# Altium schematic sheet BREW_MONITOR.SchDoc
size A3; Author: Marc-Andre Guimond; Organization: Geni Ale; Address1: 1100; Address2: Notre-Dame Ouest; Address3: Montreal, QC; Address4: Canada
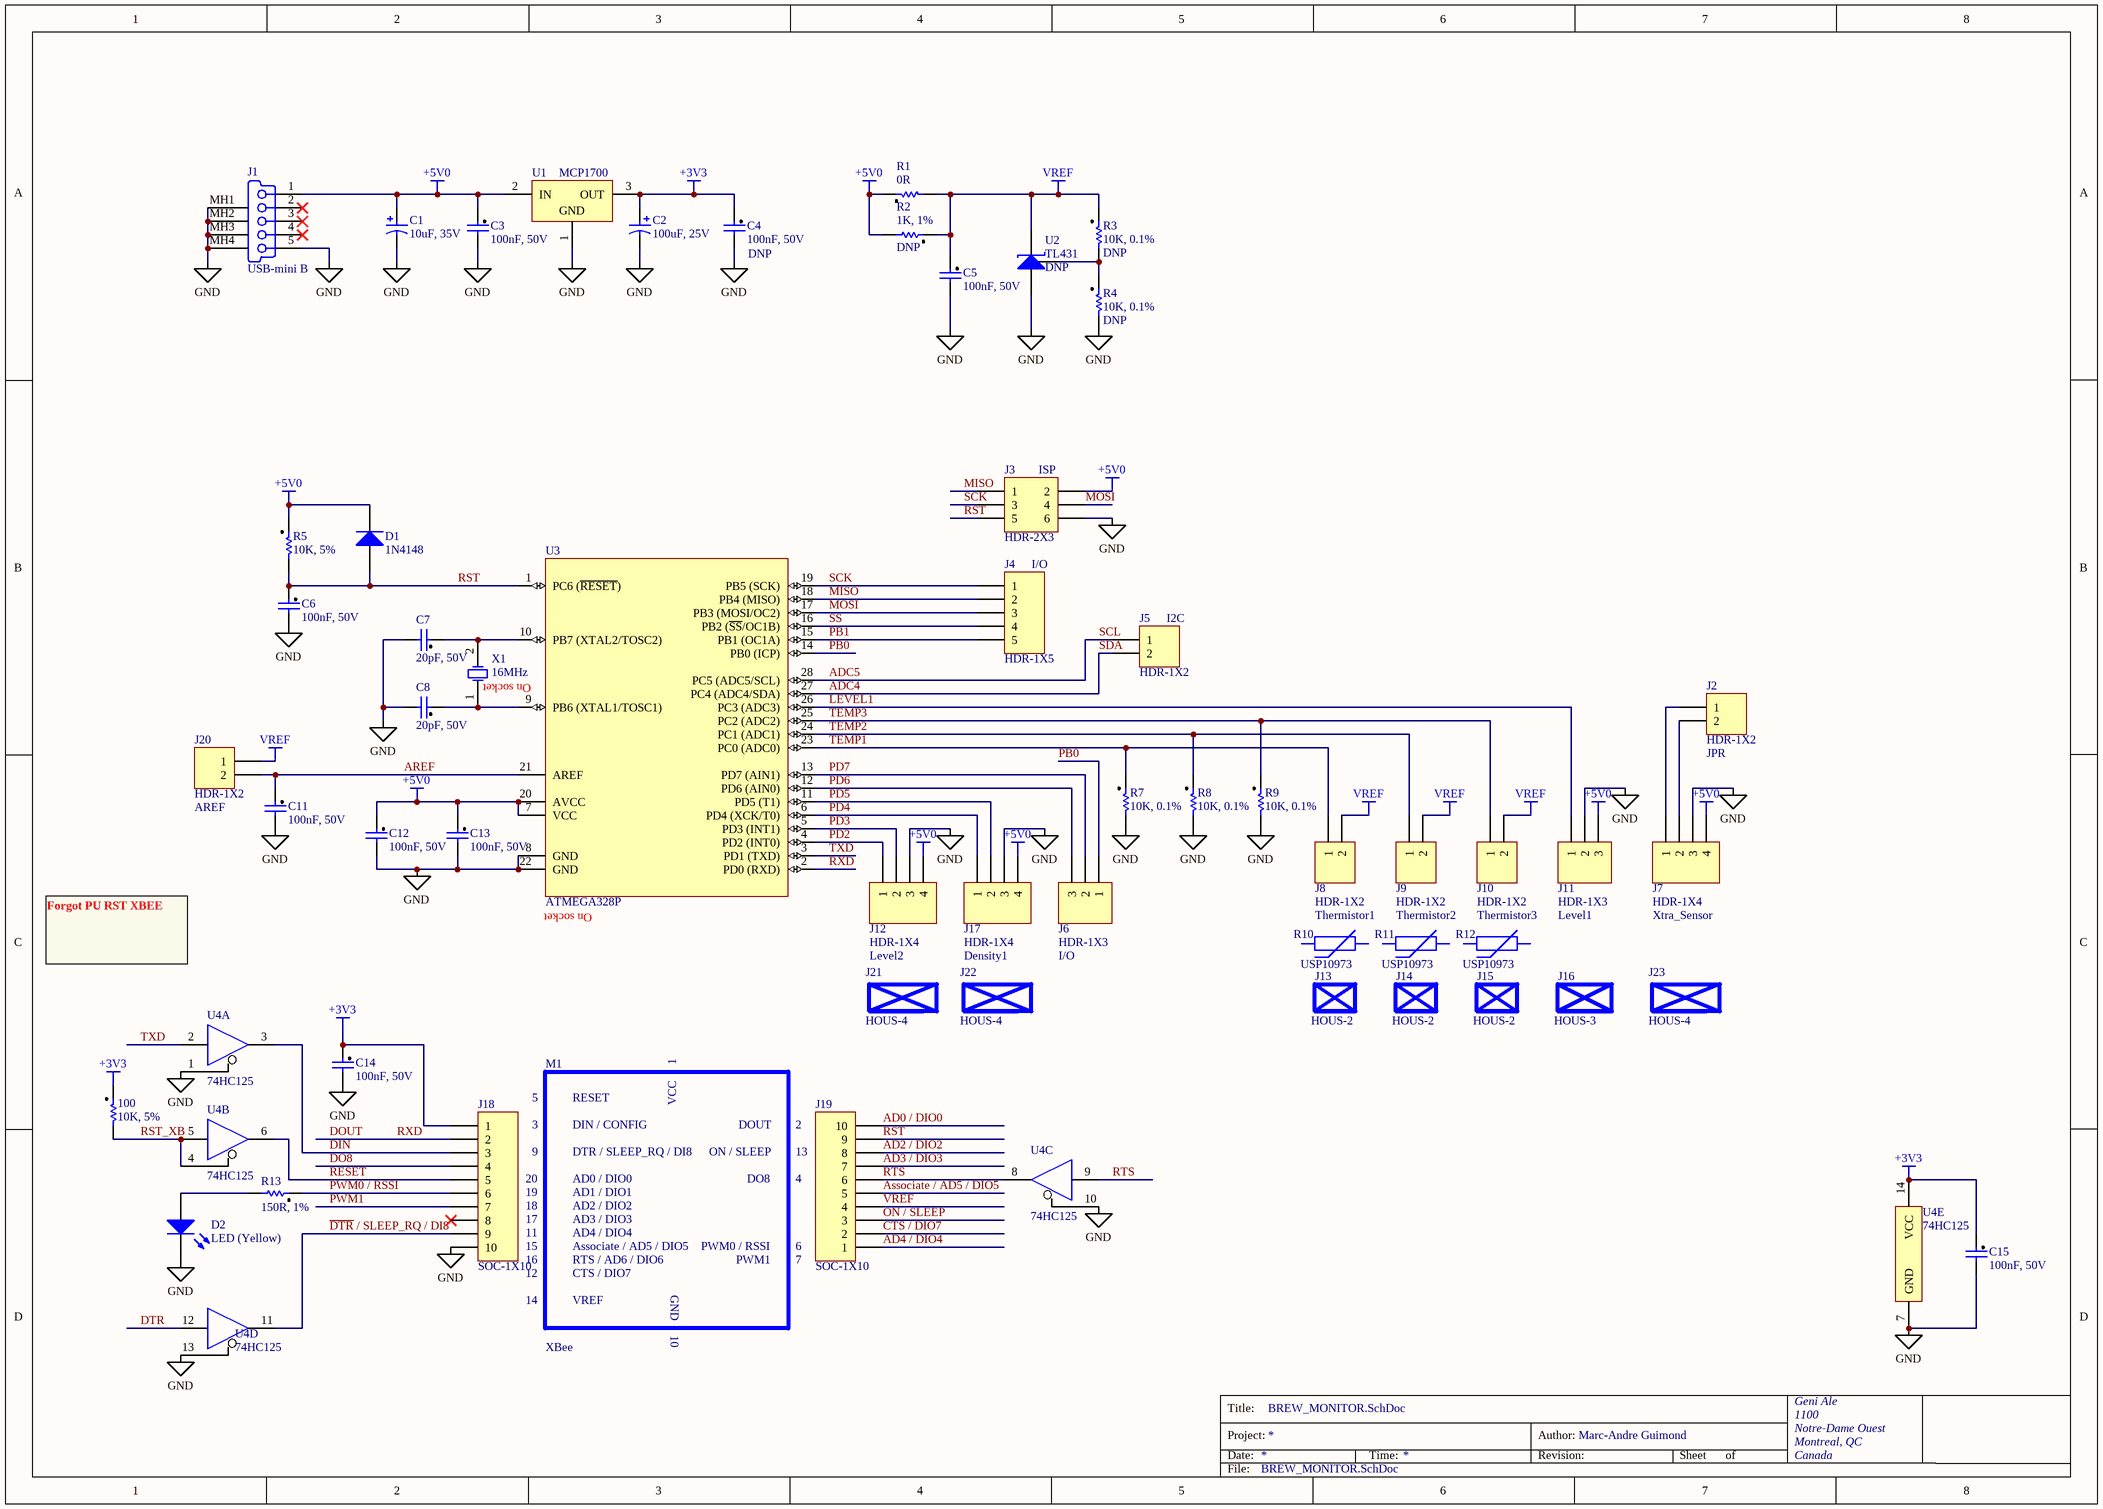
[diagram p0: BREW_MONITOR.SchDoc]

## Parts
100  10K, 5%  [0805 (2012 Metric)]
C1  10uF, 35V  [CAP_RAD-2.0]
C2  100uF, 25V  [CAP_RAD-2.0]
C3  100nF, 50V  [0805 (2012 Metric)]
C4  100nF, 50V  Populate: DNP  [0805 (2012 Metric)]
C5  100nF, 50V  [0805 (2012 Metric)]
C6  100nF, 50V  [0805 (2012 Metric)]
C7  20pF, 50V  [0603 (1608 Metric)]
C8  20pF, 50V  [0603 (1608 Metric)]
C11  100nF, 50V  [0805 (2012 Metric)]
C12  100nF, 50V  [0805 (2012 Metric)]
C13  100nF, 50V  [0805 (2012 Metric)]
C14  100nF, 50V  [0805 (2012 Metric)]
C15  100nF, 50V  [0805 (2012 Metric)]
D1  1N4148  [DO-35]
D2  LED (Yellow)  [LED-1]
J1  USB-mini B  [CON_USB-UX60SC]
J2  HDR-1X2  REF: JPR  [HDR1X2]
J3  HDR-2X3  [HDR2X3]
J4  HDR-1X5  REF: I/O  [HDR1X5]
J5  HDR-1X2  REF: I2C  [HDR1X2]
J6  HDR-1X3  REF: I/O  [HDR1X3]
J7  HDR-1X4  REF: Xtra_Sensor  [HDR1X4_RA POL_SHR_TE]
J8  HDR-1X2  REF: Thermistor1  [HDR1X2_RA POL_SHR_TE]
J9  HDR-1X2  REF: Thermistor2  [HDR1X2_RA POL_SHR_TE]
J10  HDR-1X2  REF: Thermistor3  [HDR1X2_RA POL_SHR_TE]
J11  HDR-1X3  REF: Level1  [HDR1X3_RA POL_SHR_TE]
J12  HDR-1X4  REF: Level2  [HDR1X4_RA POL_SHR_TE]
J13  HOUS-2  [NO_FOOT]
J14  HOUS-2  [NO_FOOT]
J15  HOUS-2  [NO_FOOT]
J16  HOUS-3  [NO_FOOT]
J17  HDR-1X4  REF: Density1  [HDR1X4_RA POL_SHR_TE]
J18  SOC-1X10  [SOC1X10 2MM]
J19  SOC-1X10  [SOC1X10 2MM]
J20  HDR-1X2  REF: AREF  [HDR1X2]
J21  HOUS-4  [NO_FOOT]
J22  HOUS-4  [NO_FOOT]
J23  HOUS-4  [NO_FOOT]
M1  XBee  [XBee-20]
R1  0R  [JPR-0.2]
R2  1K, 1%  Populate: DNP  [0805 (2012 Metric)]
R3  10K, 0.1%  Populate: DNP  [0805 (2012 Metric)]
R4  10K, 0.1%  Populate: DNP  [0805 (2012 Metric)]
R5  10K, 5%  [0805 (2012 Metric)]
R7  10K, 0.1%  [0805 (2012 Metric)]
R8  10K, 0.1%  [0805 (2012 Metric)]
R9  10K, 0.1%  [0805 (2012 Metric)]
R10  USP10973  [NO_FOOT]
R11  USP10973  [NO_FOOT]
R12  USP10973  [NO_FOOT]
R13  150R, 1%  [0805 (2012 Metric)]
U1  MCP1700  [TO-92A_L]
U2  TL431  Populate: DNP  [TO-92A_L]
U3  ATMEGA328P  [DIP-28]
U4  74HC125  [DIP-14]  (parts A,B,C,D,E of 5)
X1  16MHz  [HC49U]

## Nets
+3V3: 100.1 C2.1 C4.1 C14.1 C15.1 J18.1 U1.3(OUT) U4.14(VCC)
+5V0: C1.1 C3.1 C12.1 C13.1 D1.2(K) J1.1(V_BUS_(5V)) J3.2 J7.4 J11.3 J12.4 J17.4 R1.1 R2.2 R5.1 U1.2(IN) U3.7(VCC) U3.20(AVCC)
GND: C1.2 C2.2 C3.2 C4.2 C5.2 C6.2 C7.2 C8.2 C11.2 C12.2 C13.2 C14.2 C15.2 D2.2(K) J1.5(GND) J1.MH1(Tab) J1.MH2(Tab) J1.MH3(Tab) J1.MH4(Tab) J3.6 J7.3 J11.2 J12.3 J17.3 J18.10 R4.2 R7.2 R8.2 R9.2 U1.1(ADJ) U2.2(A) U3.8(GND) U3.22(GND) U4.1(~{OE}1) U4.7(GND) U4.10(~{OE}3) U4.13(~{OE}4)
VREF: C5.1 J8.2 J9.2 J10.2 J19.4 J20.1 R1.2 R2.1 R3.1 U2.3(K)
AD0 / DIO0: J19.10
AD2 / DIO2: J19.8
AD3 / DIO3: J19.7
AD4 / DIO4: J19.1
ADC4: J5.2 U3.27(PC4_(ADC4/SDA))  [also labelled SDA]
ADC5: J5.1 U3.28(PC5_(ADC5/SCL))  [also labelled SCL]
AREF: C11.1 J20.2 U3.21(AREF)
Associate / AD5 / DIO5: J19.5
~{CTS} / DIO7: J19.2
~{DTR} / SLEEP_RQ / DI8: J18.9 U4.11(Y4)
DIN: J18.3 U4.3(Y1)
DO8: J18.4
DOUT: J18.2 U3.2(PD0_(RXD))  [also labelled RXD]
DTR: U4.12(A4)
LEVEL1: J11.1 U3.26(PC3_(ADC3))
MISO: J3.1 J4.2 U3.18(PB4_(MISO))
MOSI: J3.4 J4.3 U3.17(PB3_(MOSI/OC2))
ON / SLEEP: J19.3
PB0: J6.1 U3.14(PB0_(ICP))
PB1: J4.5 U3.15(PB1_(OC1A))
PD2: J12.1 U3.4(PD2_(INT0))
PD3: J12.2 U3.5(PD3_(INT1))
PD4: J17.1 U3.6(PD4_(XCK/T0))
PD5: J17.2 U3.11(PD5_(T1))
PD6: J6.3 U3.12(PD6_(AIN0))
PD7: J6.2 U3.13(PD7_(AIN1))
PWM0 / RSSI: J18.6 R13.1
PWM1: J18.7
~{RTS}: J19.6 U4.8(Y3)
RESET: J18.5 U4.6(Y2)
RST: C6.1 D1.1(A) J3.5 J19.9 R5.2 U3.1(PC6_(~{RESET}))
RST_XB: 100.2 U4.4(~{OE}2) U4.5(A2)
RTS: U4.9(A3)
SCK: J3.3 J4.1 U3.19(PB5_(SCK))
SS: J4.4 U3.16(PB2_(~{SS}/OC1B))
TEMP1: J8.1 R7.1 U3.23(PC0_(ADC0))
TEMP2: J9.1 R8.1 U3.24(PC1_(ADC1))
TEMP3: J10.1 R9.1 U3.25(PC2_(ADC2))
TXD: U3.3(PD1_(TXD)) U4.2(A1)
NetC7_1: C7.1 U3.10(PB7_(XTAL2/TOSC2)) X1.2(OSC2)
NetC8_1: C8.1 U3.9(PB6_(XTAL1/TOSC1)) X1.1(OSC1)
NetD2_1: D2.1(A) R13.2
NetJ2_1: J2.1 J7.1
NetJ2_2: J2.2 J7.2
NetR3_2: R3.2 R4.1 U2.1(REF)

Not connected (* = marked no-connect by the designer): J1 2(D-)* 3(D+)* 4(NC)*; J18 8*

## Notes on the sheet
- (near J3) ISP
- (near X1) On socket
- (near U3) On socket
- Forgot PU RST XBEE
- Title:
- Date:
- Project:
- Time:
- Revision:
- Author:
- Sheet
- of
- File:
- (in symbol MCP1700-3302E/TO) GND
- (in symbol XB24-AWI-001) 1; 5; RESET; VCC; 3; DIN / CONFIG; DOUT; 2; 9; DTR / SLEEP_RQ / DI8; ON / SLEEP; 13; 20; AD0 / DIO0; DO8; 4; 19; AD1 / DIO1; 18; AD2 / DIO2; 17; AD3 / DIO3; 11; AD4 / DIO4; 15; Associate / AD5 / DIO5; PWM0 / RSSI; 6; 16; RTS / AD6 / DIO6; PWM1; 7; 12; CTS / DIO7; GND; 14; VREF; 10

## Library data of the parts
100 R5 = RMCF0805JT10K0: RES 10K OHM 1/8W 5% 0805; Manufacturer: Stackpole Electronics Inc; Power: 0.125W, 1/8W; Mfg.PN: RMCF0805JT10K0; RoHSStatus: Compliant; GRRComment: 10K, 5%; Mounting: Surface Mount; Package: 0805 (2012 Metric); Tolerance: 5%; Resistance: 10K; Composition: Thick Film; Emplacement: *
C1 = ESK106M035AC3AA: CAP ALUM 10UF 35V 20% RADIAL; Manufacturer: Kemet; CapType: Aluminum; RippleCurrent: 60mA; MinTemp: -40C; MaxTemp: +85C; OtherNames: SK106M035AC3AAKPLP, 399-6598; HelpURL: C:\Users\Mark\Documents\Dropbox\GRR_Systems\02- Inventaires\Datasheets\KEM_A4004_ESK.pdf; Mounting: Through Hole; Voltage: 35V; Package: Radial, Can; Tolerance: ±20%; Capacitance: 10uF; Height: 0.492" (12.50mm); Mfg.PN: ESK106M035AC3AA; RoHSStatus: Compliant; GRRComment: 10uF, 35V; Emplacement: *
C2 = ESK107M025AC3AA: CAP ALUM 100UF 25V 20% RADIAL; Manufacturer: Kemet; MinTemp: -40C; MaxTemp: +85C; OtherNames: 399-6102; CapType: Aluminum; RippleCurrent: --mA; Mfg.PN: ESK107M025AC3AA; HelpURL: C:\Users\Mark\Documents\Dropbox\GRR_Systems\02- Inventaires\Datasheets\KEM_A4004_ESK.pdf; RoHSStatus: Compliant; GRRComment: 100uF, 25V; Mounting: Through Hole; Voltage: 25V; Package: Radial, Can; Tolerance: ±20%; Capacitance: 100uF; Height: 0.492" (12.50mm); Emplacement: *
C3-C6 C11-C15 = C2012X7R1H104K085AA: CAP CER 0.1UF 50V 10% X7R 0805; Manufacturer: TDK Corporation; MinTemp: -55C; MaxTemp: +125C; CapType: Ceramic; Mfg.PN: C2012X7R1H104K085AA; HelpURL: *; RoHSStatus: Compliant; GRRComment: 100nF, 50V; Mounting: Surface Mount, MLCC; Voltage: 50V; Package: 0805 (2012 Metric); Tolerance: ±10%; Capacitance: 100nF; Emplacement: *; TemperatureCoeff: X7R; MaxThickness: 0.037" (0.95mm)
C7 C8 = CC0603JRNPO9BN200: CAP CER 20PF 50V 5% NPO 0603; Manufacturer: Yageo; MinTemp: -55C; MaxTemp: +125C; CapType: Ceramic; TemperatureCoeff: C0G, NP0; Mfg.PN: CC0603JRNPO9BN200; HelpURL: *; RoHSStatus: Compliant; GRRComment: 20pF, 50V; Mounting: Surface Mount, MLCC; Voltage: 50V; Package: 0603 (1608 Metric); Tolerance: ±5%; Capacitance: 20pF; MaxThickness: -; Emplacement: *
D1 = 1N4148TACT: DIODE SMALL SIG 100V 0.2A DO35; Manufacturer: Fairchild Semiconductor; Io: 200mA; DiodeType: Rectifier; Vf@IfMax: 1V @ 10mA; VrMax: 5µA @ 75V; MaxTemp: +65C; MinTemp: -40C; Emplacement: DIODE DRAWER; PackageReference: DO-35; ComponentLink1Description: Manufacturer Link; ComponentLink1URL: http://www.fairchildsemi.com/; ComponentLink2Description: Datasheet; ComponentLink2URL: http://www.fairchildsemi.com/ds/1N%2F1N4148.pdf; HelpURL: C:\Users\Mark\Google Drive\GRR_Systems\02-Inventaires\Datasheets\1N4148.pdf; Mounting: Through Hole; Package: DO-204AH, DO-35, Axial; Mfg.PN: 1N4148TA; OtherNames: 1N4148TACT; GRRComment: 1N4148; RoHSStatus: Compliant
D2 = LTL-307Y: LED 5MM YELLOW DIFFUSED; Manufacturer: Lite-On Inc; If: 20mA; Vf: 2.1V; VrMax: 5V; ViewingAngle: 50°; HelpURL: C:\Users\Mark\Documents\Dropbox\GRR_Systems\02- Inventaires\Datasheets\P_100_LTL-307Y.pdf; Mfg.PN: LTL-307Y; Mounting: Through Hole; Package: Radial; GRRComment: LED (Yellow); RoHSStatus: Compliant; Emplacement: *
J1 = UX60SC-MB-5ST(80): CONN RCPT USB MINI B R/A SMD; Manufacturer: Hirose Electric Co Ltd; NumberPositions: 5; HelpURL: C:\Users\Mark\Google Drive\GRR_Systems\02-Inventaires\Datasheets\e24000153.pdf; GRRComment: USB-mini B; Mfg.PN: UX60SC-MB-5ST(80); RoHSStatus: Compliant; Mounting: Surface Mount, Right Angle, Horizontal; ConnectorType: USB-mini B; Emplacement: *
J2 J5 J20 = PRPC002SAAN-RC: CONN HEADER .100" SNGL STR 2POS; Manufacturer: Sullins Connector Solutions; OtherNames: S9513E-02, S9513E-02-ND; NumberPositions: 2; ConnectorType: Header, Unshrouded; Pitch: 0.100" (2.54mm); ContactMatingLength: 0.230" (5.84mm); Emplacement: CON BOX; HelpURL: C:\Users\Mark\Google Drive\GRR_Systems\02-Inventaires\Datasheets\PRPC040SxAN-M71RC.pdf; GRRComment: HDR-1X2; Mfg.PN: PRPC002SAAN-RC; RoHSStatus: Compliant; Mounting: Through Hole
J3 = XG8T-0631: JUMPER PLUG 6POS DOUBLE ROW; Manufacturer: Omron Electronics Inc-EMC Div; NumberPositions: 6; ConnectorType: Header, Unshrouded; Pitch: 0.100" (2.54mm); ContactMatingLength: 0.169" (4.30mm); OtherNames: OR1108, XG8T-0631-ND, XG8T0631; Emplacement: CON BOX; HelpURL: C:\Users\Mark\Google Drive\GRR_Systems\02-Inventaires\Datasheets\XJ8_XG8S_XG8T_1110.pdf; Mounting: Through Hole; GRRComment: HDR-2X3; Mfg.PN: XG8T-0631; RoHSStatus: Compliant
J4 = PRPC005SAAN-RC: CONN HEADER .100" SNGL STR 5POS; Manufacturer: Sullins Connector Solutions; OtherNames: S9513E-03, S9513E-40, S9513E-40-ND; NumberPositions: 5; ConnectorType: Header, Unshrouded; Pitch: 0.100" (2.54mm); ContactMatingLength: 0.230" (5.84mm); Emplacement: CON BOX; HelpURL: C:\Users\Mark\Google Drive\GRR_Systems\02-Inventaires\Datasheets\PRPC040SxAN-M71RC.pdf; GRRComment: HDR-1X5; Mfg.PN: PRPC005SAAN-RC; RoHSStatus: Compliant; Mounting: Through Hole
J6 = PRPC003SAAN-RC: CONN HEADER .100" SNGL STR 3POS; Manufacturer: Sullins Connector Solutions; OtherNames: S9513E-03, S9513E-40, S9513E-40-ND; NumberPositions: 3; ConnectorType: Header, Unshrouded; Pitch: 0.100" (2.54mm); ContactMatingLength: 0.230" (5.84mm); Emplacement: CON BOX; HelpURL: C:\Users\Mark\Google Drive\GRR_Systems\02-Inventaires\Datasheets\PRPC040SxAN-M71RC.pdf; GRRComment: HDR-1X3; Mfg.PN: PRPC003SAAN-RC; RoHSStatus: Compliant; Mounting: Through Hole
J7 J12 J17 = 2-644488-4: CONN HEADER RTANG 4POS .100 TIN; Manufacturer: TE Connectivity; NumberPositions: 4; ConnectorType: Header, Shrouded; Pitch: 0.100" (2.54mm); ContactMatingLength: 0.200" (5.08mm); HelpURL: C:\Users\Mark\Google Drive\GRR_Systems\02-Inventaires\Datasheets\ENG_CD_644488_L_baseFilename.pdf; GRRComment: HDR-1X4; Mfg.PN: 2-644488-4; RoHSStatus: Compliant; Mounting: Through Hole, Right Angle; Emplacement: *; Features: Friction Lock
J8-J10 = 2-644488-2: CONN HEADER RTANG 2POS .100 TIN; Manufacturer: TE Connectivity; NumberPositions: 2; ConnectorType: Header, Shrouded; Pitch: 0.100" (2.54mm); ContactMatingLength: 0.200" (5.08mm); HelpURL: C:\Users\Mark\Google Drive\GRR_Systems\02-Inventaires\Datasheets\ENG_CD_644488_L_baseFilename.pdf; GRRComment: HDR-1X2; Mfg.PN: 2-644488-2; RoHSStatus: Compliant; Mounting: Through Hole, Right Angle; Emplacement: *; Features: Friction Lock
J11 = 2-644488-3: CONN HEADER RTANG 3POS .100 TIN; Manufacturer: TE Connectivity; NumberPositions: 3; ConnectorType: Header, Shrouded; Pitch: 0.100" (2.54mm); ContactMatingLength: 0.200" (5.08mm); HelpURL: C:\Users\Mark\Google Drive\GRR_Systems\02-Inventaires\Datasheets\ENG_CD_644488_L_baseFilename.pdf; GRRComment: HDR-1X3; Mfg.PN: 2-644488-3; RoHSStatus: Compliant; Mounting: Through Hole, Right Angle; Emplacement: *; Features: Friction Lock
J13-J15 = 3-644083-2: CONN RCPT 2POS 22AWG POL MTA100; Manufacturer: TE Connectivity; NumberPositions: 2; ConnectorType: Receptacle; Pitch: 0.100" (2.54mm); HelpURL: *; GRRComment: HOUS-2; Mfg.PN: 3-644083-2; RoHSStatus: Compliant; Mounting: Free Hanging (In-Line); Emplacement: *; Series: MTA-100, AMP; Wire Gauge: 22 AWG
J16 = 3-644083-3: CONN RCPT 3POS 22AWG POL MTA100; Manufacturer: TE Connectivity; NumberPositions: 3; ConnectorType: Receptacle; Pitch: 0.100" (2.54mm); HelpURL: *; GRRComment: HOUS-3; Mfg.PN: 3-644083-3; RoHSStatus: Compliant; Mounting: Free Hanging (In-Line); Emplacement: *; Series: MTA-100, AMP; Wire Gauge: 22 AWG
J18 J19 = 950510-6102-AR: CONN SOCKET 10POS 2MM VERT T/H; Manufacturer: 3M; NumberPositions: 10; ConnectorType: Receptacle; Pitch: 0.079" (2.00mm); Emplacement: CON BOX; HelpURL: C:\Users\Mark\Google Drive\GRR_Systems\02-Inventaires\Datasheets\ts2155.pdf; GRRComment: SOC-1X10; Mfg.PN: 950510-6102-AR; RoHSStatus: Compliant; Mounting: Through Hole
J21-J23 = 3-644083-4: CONN RCPT 4POS 22AWG POL MTA100; Manufacturer: TE Connectivity; NumberPositions: 4; ConnectorType: Receptacle; Pitch: 0.100" (2.54mm); HelpURL: *; GRRComment: HOUS-4; Mfg.PN: 3-644083-4; RoHSStatus: Compliant; Mounting: Free Hanging (In-Line); Emplacement: *; Series: MTA-100, AMP; Wire Gauge: 22 AWG
M1 = XB24-AWI-001: MODULE 802.15.4 1MW W/WIRE ANT; Manufacturer: Digi International/Maxstream; Frequency: 2.4GHz; OtherNames: XB24AWI001; MinTemp: -40C; MaxTemp: +85C; Emplacement: XBEE BOX; HelpURL: C:\Users\Mark\Documents\Dropbox\GRR_Systems\02- Inventaires\Datasheets\XB24-AWI-001.pdf; Mfg.PN: XB24-AWI-001; RoHSStatus: Compliant; GRRComment: XBee
R1 = JUMPER: RES 0R; Power: 0.333W, 1/3W; GRRComment: 0R; Mounting: Through Hole; Package: 1206 (3216 Metric); Resistance: 0R; Composition: Lead; Emplacement: *
R2 = RMCF0805FT1K00: RES 1K OHM 1/8W 1% 0805; Manufacturer: Stackpole Electronics Inc; Power: 0.125W, 1/8W; Mfg.PN: RMCF0805FT1K00; RoHSStatus: Compliant; GRRComment: 1K, 1%; Mounting: Surface Mount; Package: 0805 (2012 Metric); Tolerance: 1%; Resistance: 1K; Composition: Thick Film; Emplacement: *
R3 R4 R7-R9 = CRT0805-BY-1002ELF: RES 10K OHM 1/8W .1% 0805 SMD; Manufacturer: Bourns Inc.; Power: 0.125W, 1/8W; Mfg.PN: CRT0805-BY-1002ELF; RoHSStatus: Compliant; GRRComment: 10K, 0.1%; Mounting: Surface Mount; Package: 0805 (2012 Metric); Tolerance: 0.1%; Resistance: 10K; Composition: Thin Film; Emplacement: *
R10-R12 = USP10973: THERMISTOR ASSEMBLY 10K OHM; Manufacturer: US Sensor; Tolerance: ±1%; OtherNames: USP10973RA; MaxTemp: +105C; CurveType: J; Emplacement: SENSOR BOX; SensorType: Thermistor - NTC; Mfg.PN: USP10973; RoHSStatus: Compiant; Resistance: 10K; Mounting: Free Hanging; Package: Cylindrical Probe, Copper; HelpURL: C:\Users\Mark\Google Drive\GRR_Systems\02-Inventaires\Datasheets\USP10973.pdf; GRRComment: USP10973
R13 = RMCF0805FT150R: RES 150 OHM 1/8W 1% 0805; Manufacturer: Stackpole Electronics Inc; Power: 0.125W, 1/8W; Mfg.PN: RMCF0805FT150R; RoHSStatus: Compliant; GRRComment: 150R, 1%; Mounting: Surface Mount; Package: 0805 (2012 Metric); Tolerance: 1%; Resistance: 150R; Composition: Thick Film; Emplacement: *
U1 = MCP1700-3302E/TO: IC REG LDO 3.3V 0.25A TO92-3; Manufacturer: Microchip Technology; MinTemp: -40C; MaxTemp: +125C; ICType: Regulator; VoltageInput: Up to 6V; CurrentOutput: 250mA; OutputType: Positive Fixed; Mfg.PN: MCP1700-3302E/TO; HelpURL: C:\Users\Mark\Google Drive\GRR_Systems\02-Inventaires\Datasheets\20001826C.pdf; RoHSStatus: Compliant; GRRComment: MCP1700; Package: TO-92-3; Mounting: Through Hole; PMICType: LDO; VoltageOutput: 3.3V; Emplacement: *
U2 = TL431CZ: IC VREF SHUNT PREC ADJ TO-92-3; Manufacturer: STMicroelectronics; Io: 100mA; Tolerance: ±2%; VoltageOutput: 2.495 V ~ 36 V; MinTemp: 0C; MaxTemp: +70C; RefenrenceType: Shunt, Adjustable, Precision; CurrentCathode: 1mA; PackageReference: TO-226-2, TO-92-2 (TO-226AC); Mounting: Through Hole; Package: TO-92-3; HelpURL: C:\Users\Mark\Google Drive\GRR_Systems\02-Inventaires\Datasheets\CD00000986.pdf; Mfg.PN: TL431CZ; RoHSStatus: Compliant; GRRComment: TL431; VoltageInput: 2.495 V ~ 36 V; Emplacement: *
U3 = ATMEGA328P-PU: IC MCU 8BIT 32KB FLASH 28DIP; Manufacturer: Atmel; ICType: Microcontroller; RAMSize: 2K x 8; ProgramMemoySize: 32KB (16K x 16); NumberIO: 23; CoreSize: 8-Bit; Connectivity: I²C, SPI, UART/USART; Peripherals: Brown-out Detect/Reset, POR, PWM, WDT; Speed: 20MHz; EEPROM Size: 1K x 8; Data Converters: A/D 6x10b; MaxTemp: +85C; MinTemp: -40C; Emplacement: MCU TUBE; ComponentLink1Description: Datasheet Summary; ComponentLink1URL: C:\Users\Mark\Google Drive\GRR_Systems\02-Inventaires\Datasheets\Summary_ATmega48a-48pa-88a-88pa-168a-168pa-328-328p.pdf; ComponentLink2Description: Full Datasheet; ComponentLink2URL: C:\Users\Mark\Google Drive\GRR_Systems\02-Inventaires\Datasheets\Datasheet_ATmega48A-48PA-88A-88PA-168A-168PA-328-328P.pdf; HelpURL: C:\Users\Mark\Google Drive\GRR_Systems\02-Inventaires\Datasheets\Summary_ATmega48a-48pa-88a-88pa-168a-168pa-328-328p.pdf; Mounting: Through Hole; Package: 28-DIP; Sample: http://www.atmel.com/devices/atmega328p.aspx#__utma=51109366.424545062.1383850110.1383850110.1383850110.1&__utmb=51109366.0.10.1383850110&__utmc=51109366&__utmx=-&__utmz=51109366.1383850110.1.1.utmcsr=(direct)|utmccn=(direct)|utmcmd=(none)&__utmv=-&__utmk=216003795; GRRComment: ATMEGA328P; Mfg.PN: ATMEGA328P-PU; RoHSStatus: Compliant
U4 = SN74AHC125N: IC BUS BUFFER TRI-ST QD 14DIP; Manufacturer: Texas Instruments; ICType: Logic Buffer; NumberCircuits: 4; MinTemp: -40C; MaxTemp: +85C; Emplacement: LOGIC TUBE; HelpURL: C:\Users\Mark\Google Drive\GRR_Systems\02-Inventaires\Datasheets\sn74ahc125.pdf; Package: 14-DIP (0.300", 7.62mm); Mounting: Through Hole; ComponentLink1Description: Manufacturer Link; ComponentLink1URL: http://www.ti.com/; ComponentLink2Description: Datasheet; ComponentLink2URL: http://www-s.ti.com/sc/ds/sn74ahc125.pdf; Sample: http://www.ti.com/; Mfg.PN: SN74AHC125N; RoHSStatus: Compliant; GRRComment: 74HC125
X1 = FOXLF160-20: CRYSTAL16MHZ 20PF THRU; Manufacturer: Fox Electronics; ESR: 20 Ohm; OperatingMode: Fundamental; FrequencyStability: ±50ppm; FrequencyTolerance: ±30ppm; MaxTemp: +70C; MinTemp: -20C; Emplacement: CRYSTAL DRAWER; Mounting: Through Hole; Frequency: 16MHz; Package: HC49/U; Load Capacitance: 20pF; Mfg.PN: FOXLF160-20; RoHSStatus: Compliant; GRRComment: 16MHz